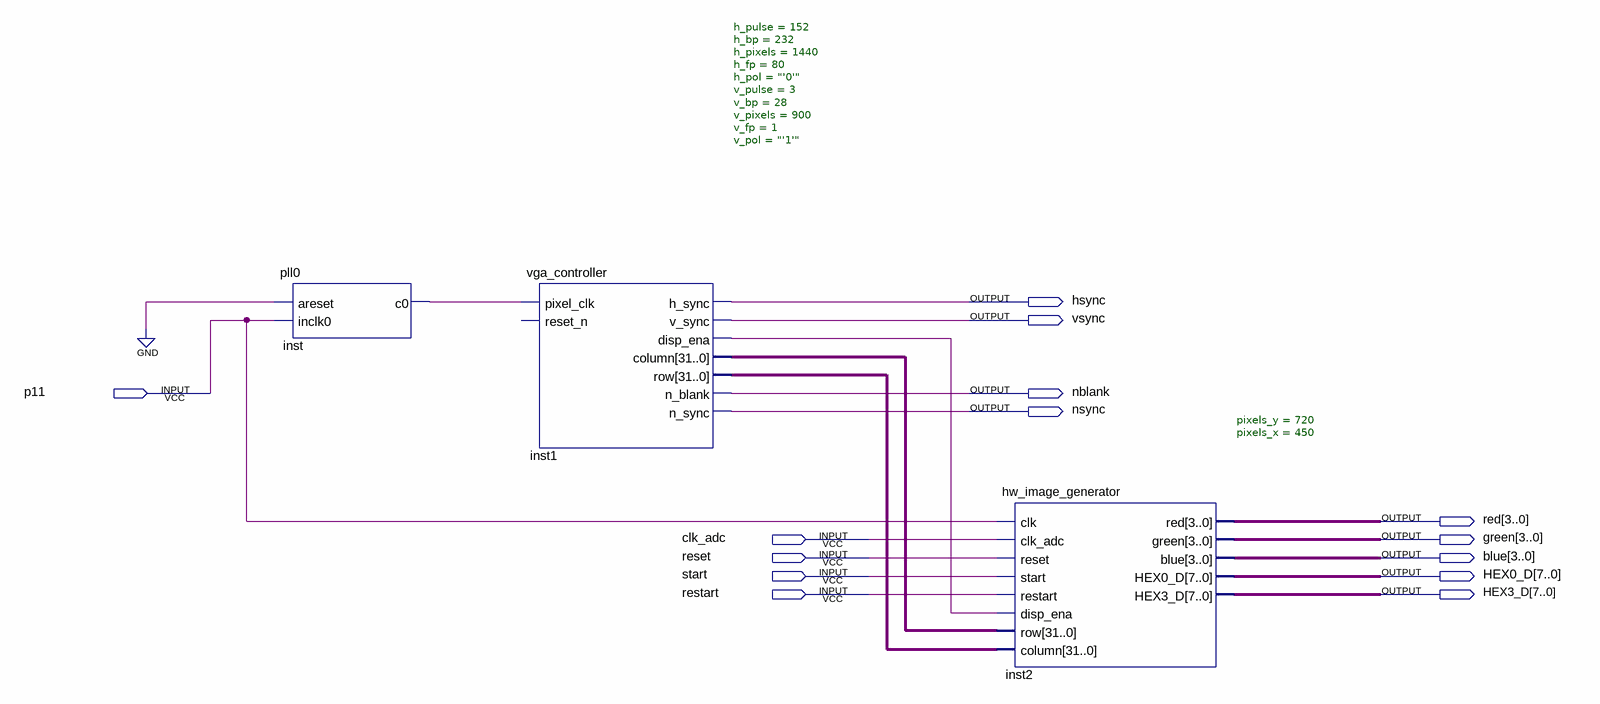
[diagram p0: schematic sheet]
// Quartus schematic pong_vga.bdf as structural Verilog: 3 symbols, 14 pins
module pong_vga (
  input  p11,
  input  clk_adc,
  input  reset,
  input  start,
  input  restart,
  output hsync,
  output vsync,
  output nblank,
  output nsync,
  output [3:0] red,
  output [3:0] green,
  output [3:0] blue,
  output [7:0] HEX0_D,
  output [7:0] HEX3_D
);

  wire inst1_disp_ena, inst_c0;
  wire [31:0] inst1_column, inst1_row;

  pll0 inst (.areset(1'b0), .inclk0(p11), .c0(inst_c0));
  vga_controller #(.h_pulse(152), .h_bp(232), .h_pixels(1440), .h_fp(80), .h_pol("'0'"), .v_pulse(3), .v_bp(28), .v_pixels(900), .v_fp(1), .v_pol("'1'")) inst1 (
    .pixel_clk(inst_c0), .h_sync(hsync), .v_sync(vsync), .disp_ena(inst1_disp_ena), .column(inst1_column),
    .row(inst1_row), .n_blank(nblank), .n_sync(nsync));  // open: reset_n
  hw_image_generator #(.pixels_y(720), .pixels_x(450)) inst2 (
    .clk(p11), .clk_adc(clk_adc), .reset(reset), .start(start), .restart(restart), .disp_ena(inst1_disp_ena),
    .row(inst1_column), .column(inst1_row), .red(red), .green(green), .blue(blue), .HEX0_D(HEX0_D),
    .HEX3_D(HEX3_D));
endmodule
